# EAGLE design SparkFun_Qwiic_FS3000_1X1 (EAGLE 9.6.2)
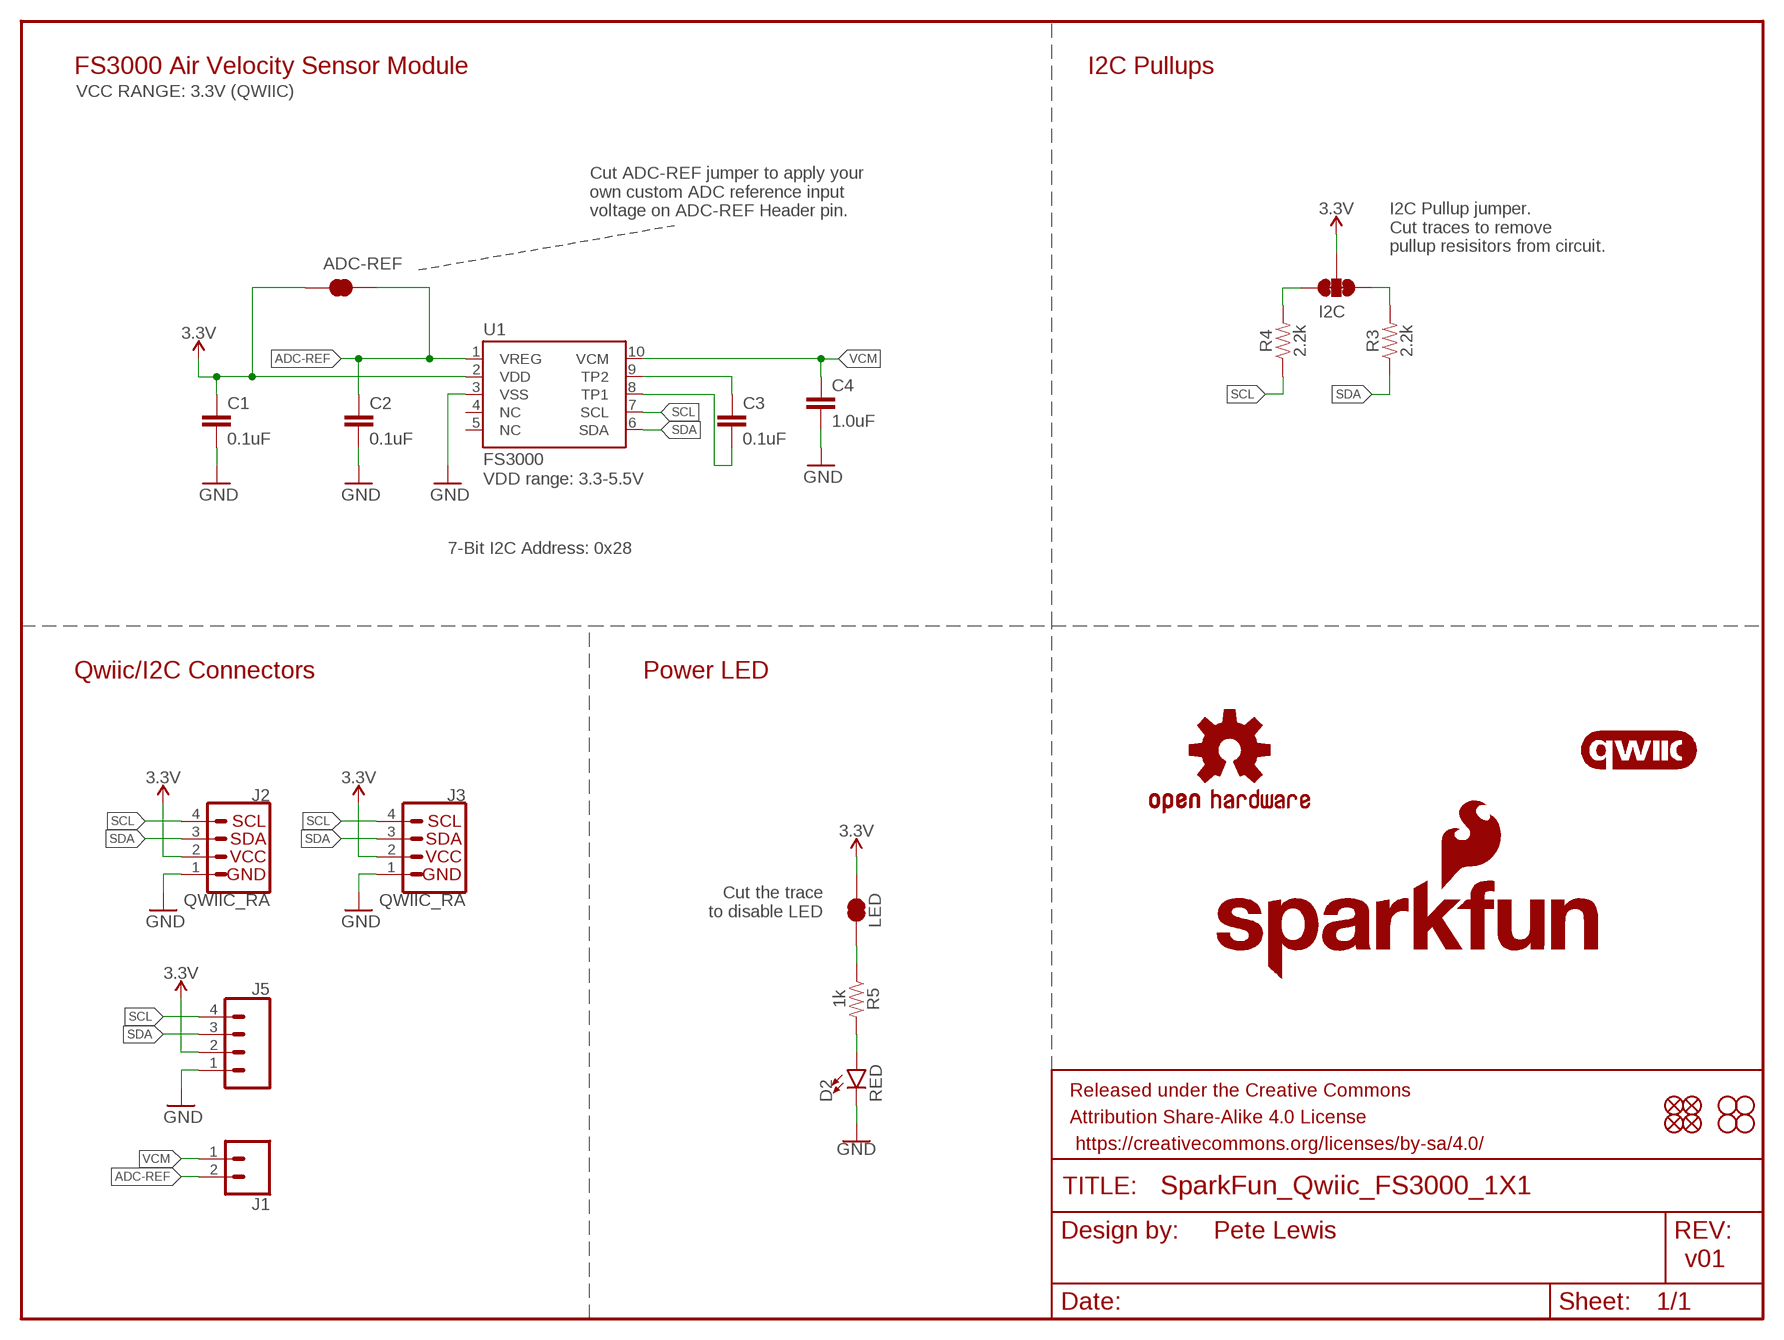
[diagram p0: schematic, sheet 1]

## Parts
ADC-REF  JUMPER-SMT_2_NC_TRACE_SILK  [SMT-JUMPER_2_NC_TRACE_SILK]
C1  0.1uF  0.1UF-0402T-16V-10%  [0402-TIGHT]
C2  0.1uF  0.1UF-0402T-16V-10%  [0402-TIGHT]
C3  0.1uF  0.1UF-0402T-16V-10%  [0402-TIGHT]
C4  1.0uF  1.0UF-0402T-16V-10%  [0402-TIGHT]
D2  RED  LED-RED0603  [LED-0603]
FRAME1  FRAME-LETTER  [CREATIVE_COMMONS]
I2C  JUMPER-SMT_3_2-NC_TRACE_SILK  [SMT-JUMPER_3_2-NC_TRACE_SILK]
J1  CONN_021X02_NO_SILK  [1X02_NO_SILK]
J2  QWIIC_RA  QWIIC_CONNECTORJS-1MM  [JST04_1MM_RA]
J3  QWIIC_RA  QWIIC_CONNECTORJS-1MM  [JST04_1MM_RA]
J5  CONN_041X04_NO_SILK  [1X04_NO_SILK]
JP1  LED  JUMPER-SMT_2_NC_TRACE_SILK  [SMT-JUMPER_2_NC_TRACE_SILK]
JP2  FIDUCIALUFIDUCIAL  [FIDUCIAL-MICRO]
JP3  STAND-OFF  [STAND-OFF]
JP4  STAND-OFF  [STAND-OFF]
JP5  FIDUCIALUFIDUCIAL  [FIDUCIAL-MICRO]
JP6  FIDUCIALUFIDUCIAL  [FIDUCIAL-MICRO]
JP7  STAND-OFF  [STAND-OFF]
JP8  STAND-OFF  [STAND-OFF]
JP11  FIDUCIALUFIDUCIAL  [FIDUCIAL-MICRO]
LOGO1  OSHW-LOGOMINI  [OSHW-LOGO-MINI]
LOGO3  SFE_LOGO_NAME_FLAME.1_INCH  [SFE_LOGO_NAME_FLAME_.1]
LOGO4  QWIIC_LOGO_5MM  [QWIIC_5MM]
LOGO5  SFE_LOGO_NAME_FLAME.1_INCH  [SFE_LOGO_NAME_FLAME_.1]
R3  2.2k  2.2KOHM-0402T-1/16W-1%  [0402-TIGHT]
R4  2.2k  2.2KOHM-0402T-1/16W-1%  [0402-TIGHT]
R5  1k  1KOHM-0402T-1/16W-1%  [0402-TIGHT]
U1  FS3000  [FS3000]

## Nets
3.3V: ADC-REF.1 C1.1 I2C.2 J2.2 J3.2 J5.2 JP1.2 U1.2(VDD)
ADC-REF: ADC-REF.2 C2.1 J1.2 U1.1(VREG)
GND: C1.2 C2.2 C4.2 D2.C J2.1 J3.1 J5.1 U1.3(VSS)
N$1: I2C.1 R3.2
N$2: I2C.3 R4.2
N$3: C3.1 U1.9(TP2)
N$4: C3.2 U1.8(TP1)
N$6: D2.A R5.2
N$8: JP1.1 R5.1
SCL: J2.4 J3.4 J5.4 R4.1 U1.7(SCL)
SDA: J2.3 J3.3 J5.3 R3.1 U1.6(SDA)
VCM: C4.1 J1.1 U1.10(VCM)
Unconnected: U1.4(NC) U1.5(NC)

## Notes on the sheet
- FS3000 Air Velocity Sensor Module | I2C Pullups
- VCC RANGE: 3.3V (QWIIC)
- Cut ADC-REF jumper to apply your 
  own custom ADC reference input 
  voltage on ADC-REF Header pin.
- I2C Pullup jumper. 
  Cut traces to remove
  pullup resisitors from circuit.
- VDD range: 3.3-5.5V
- 7-Bit I2C Address: 0x28
- Qwiic/I2C Connectors | Power LED
- Cut the trace
  to disable LED
- Pete Lewis
- v01

## Library data of the parts
ADC-REF JP1 = SparkFun-Jumpers:JUMPER-SMT_2_NC_TRACE: Normally closed trace jumper This jumper has a trace between two pads so it's normally closed (NC). Use a razor knife to open the connection. For best results follow the IPC guidelines for cutting traces: Cutout at least 0.063 mm (0.005 in). Remove all loose material to clean up the cut area. Seal the cut with an approved epoxy. Reapply solder to reclose the connection.
C1-C3 = SparkFun-Capacitors:0.1UF: 0.1µF ceramic capacitors A capacitor is a passive two-terminal electrical component used to store electrical energy temporarily in an electric field.; PROD_ID: CAP-12416
C4 = SparkFun-Capacitors:1.0UF: 1µF ceramic capacitors A capacitor is a passive two-terminal electrical component used to store electrical energy temporarily in an electric field.; PROD_ID: CAP-12417
D2 = SparkFun-LED:LED-RED: Red SMD LED Used in manufacturing of most products at SparkFun Packages: 0603 - SMD 0603 package [Product Link] <http://docs.avagotech.com/docs/AV02-0551EN> 0603 SMART - SMD 0603 SMART package ( more efficient and expensive)[Product Link] <http://www.osram-os.com/Graphics/XPic2/00077099_0.pdf> 1206 - SMD1206 package [Product Link] <https://www.sparkfun.com/datasheets/DevTools/LilyPad/Q150OVS4.pdff> SparkFun Products: Pro Mini 328 -5V <https://www.sparkfun.com/products/821> RedBoard <https://www.sparkfun.com/products/12757> IOIO-OTG <https://www.sparkfun.com/products/13613>; PROD_ID: DIO-00819
FRAME1 = SparkFun-Aesthetics:FRAME-LETTER: Schematic Frame - Letter Standard 8.5x11 US Letter frame
I2C = SparkFun-Jumpers:JUMPER-SMT_3_2-NC_TRACE: Normally closed trace jumper (2 of 2 connections) This jumper has a trace between all three pads so they are normally closed (NC). Use a razor knife to open the connection(s). For best results follow the IPC guidelines for cutting traces: Cutout at least 0.063 mm (0.005 in). Remove all loose material to clean up the cut area. Seal the cut with an approved epoxy. Reapply solder to reclose the connection(s).
J1 = SparkFun-Connectors:CONN_02: Multi connection point. Often used as Generic Header-pin footprint for 0.1 inch spaced/style header connections On any of the 0.1 inch spaced packages, you can populate with these: Break Away Headers - Straight <https://www.sparkfun.com/products/116> (PRT-00116) Break Away Male Headers - Right Angle <https://www.sparkfun.com/products/553> (PRT-00553) Female Headers <https://www.sparkfun.com/products/115> (PRT-00115) Break Away Headers - Machine Pin <https://www.sparkfun.com/products/117> (PRT-00117) Break Away Female Headers - Swiss Machine Pin <https://www.sparkfun.com/products/743> (PRT-00743) For SCREWTERMINALS and SPRING TERMINALS visit here: Screw Terimnals on SparkFun.com <https://www.sparkfun.com/search/results?term=Screw+Terminals> (5mm/3.5mm/2.54mm spacing) This device is also useful as a general connection point to wire up your design to another part of your project. Our various solder wires solder well into these plated through hole pads. Hook-Up Wire - Assortment (Stranded, 22 AWG) <https://www.sparkfun.com/products/11375> (PRT-11375) Hook-Up Wire - Assortment (Solid Core, 22 AWG) <https://www.sparkfun.com/products/11367> (PRT-11367) View the entire wire category on our website here <https://www.sparkfun.com/categories/141> Special notes: Molex polarized connector foot print use with: PRT-08233 with associated crimp pins and housings. 2.54_SCREWTERM for use with PRT-10571. 3.5mm Screw Terminal footprints for PRT-08084 5mm Screw Terminal footprints for use with PRT-08432
J2 J3 = SparkFun-Connectors:QWIIC_CONNECTOR: SparkFun I2C Standard Qwiic Connector An SMD 1mm pitch JST connector makes it easy and quick (get it? Qwiic?) to connect I2C devices to each other. The Qwiic system <http://www.sparkfun.com/qwiic> enables fast and solderless connection between popular platforms and various sensors and actuators. We carry 200mm <https://www.sparkfun.com/products/14204>, 100mm <https://www.sparkfun.com/products/14205>, 50mm <https://www.sparkfun.com/products/14206>, and breadboard friendly <https://www.sparkfun.com/products/14207> Qwiic cables. We also offer 10 pcs strips <https://www.sparkfun.com/products/14323> the SMD connectors.; PROD_ID: CONN-13694; VALUE: QWIIC_RIGHT_ANGLE
J5 = SparkFun-Connectors:CONN_04: Multi connection point. Often used as Generic Header-pin footprint for 0.1 inch spaced/style header connections On any of the 0.1 inch spaced packages, you can populate with these: Break Away Headers - Straight <https://www.sparkfun.com/products/116> (PRT-00116) Break Away Male Headers - Right Angle <https://www.sparkfun.com/products/553> (PRT-00553) Female Headers <https://www.sparkfun.com/products/115> (PRT-00115) Break Away Headers - Machine Pin <https://www.sparkfun.com/products/117> (PRT-00117) Break Away Female Headers - Swiss Machine Pin <https://www.sparkfun.com/products/743> (PRT-00743) For SCREWTERMINALS and SPRING TERMINALS visit here: Screw Terimnals on SparkFun.com <https://www.sparkfun.com/search/results?term=Screw+Terminals> (5mm/3.5mm/2.54mm spacing) This device is also useful as a general connection point to wire up your design to another part of your project. Our various solder wires solder well into these plated through hole pads. Hook-Up Wire - Assortment (Stranded, 22 AWG) <https://www.sparkfun.com/products/11375> (PRT-11375) Hook-Up Wire - Assortment (Solid Core, 22 AWG) <https://www.sparkfun.com/products/11367> (PRT-11367) View the entire wire category on our website here <https://www.sparkfun.com/categories/141> Special notes: Molex polarized connector foot print use with SKU : PRT-08231 with associated crimp pins and housings. 1MM SMD Version SKU: PRT-10208; PROD_ID: CONN-09696
JP2 JP5 JP6 JP11 = SparkFun-Aesthetics:FIDUCIAL: Fiducial Alignment Points Point-of-reference for pick-and-place machines and other optical instruments.
JP3 JP4 JP7 JP8 = SparkFun-Hardware:STAND-OFF: Stand Off Drill holes for mechanically mounting via screws, standoffs, etc. Note: Use the keepout ring to avoid running the screw head into surrounding components. Variant Overviews STAND-OFF - Mechanical footprint for a #4 phillips button head screw. STAND-OFF-TIGHT - Mechanical footprint for a #4 phillips button head screw, Example SparkFun Products Screw - Phillips Head (1/4", 4-40, 10 pack) <https://www.sparkfun.com/products/10453> (PRT-10453) Screw - Phillips Head (1/2", 4-40, 10 pack) <https://www.sparkfun.com/products/10452> (PRT-10452) Screw - Phillips Head (3/4", 4-40, 10 pack) <https://www.sparkfun.com/products/10451> (PRT-10451) Screw - Phillips Head (1", 4-40, 10 pack) <https://www.sparkfun.com/products/10450> (PRT-10450)
LOGO1 = SparkFun-Aesthetics:OSHW-LOGO: Open-Source Hardware (OSHW) Logo This logo indicates the piece of hardware it is found on incorporates a OSHW license and/or adheres to the definition of open source hardware found here: http://freedomdefined.org/OSHW
LOGO3 LOGO5 = SparkFun-Aesthetics:SFE_LOGO_NAME_FLAME: SparkFun Font Logo w/ Flame This is the SparkFun full logo. The logo on the schematic will always be the same size; the package variant is the height of the flame part of the logo. Default layer for the logo on the board is tSilk.
LOGO4 = SparkFun-Aesthetics:QWIIC_LOGO: Qwiic Logos for placement on schematic and PCB. The 5.5mm silk logo is best for placing next to Qwiic connector.
R3 R4 = SparkFun-Resistors:2.2KOHM: 2.2kΩ resistor A resistor is a passive two-terminal electrical component that implements electrical resistance as a circuit element. Resistors act to reduce current flow, and, at the same time, act to lower voltage levels within circuits. - Wikipedia; PROD_ID: RES-14341
R5 = SparkFun-Resistors:1KOHM: 1kΩ resistor A resistor is a passive two-terminal electrical component that implements electrical resistance as a circuit element. Resistors act to reduce current flow, and, at the same time, act to lower voltage levels within circuits. - Wikipedia; PROD_ID: RES-14342
U1 = FS3000:FS3000: FS3000 Air Velocity Sensor Module by Renesas -Surface-mount type air velocity module utilizing a MEMS thermopile-based sensor. -Digital output with 12-bit resolution. The sensor comprises a “solid” thermal isolation technology and siliconcarbide coating to protect it from abrasive wear and water condensation. -Compact design fit for low profile enclosures.; PROD_ID: IC-16078

## Board
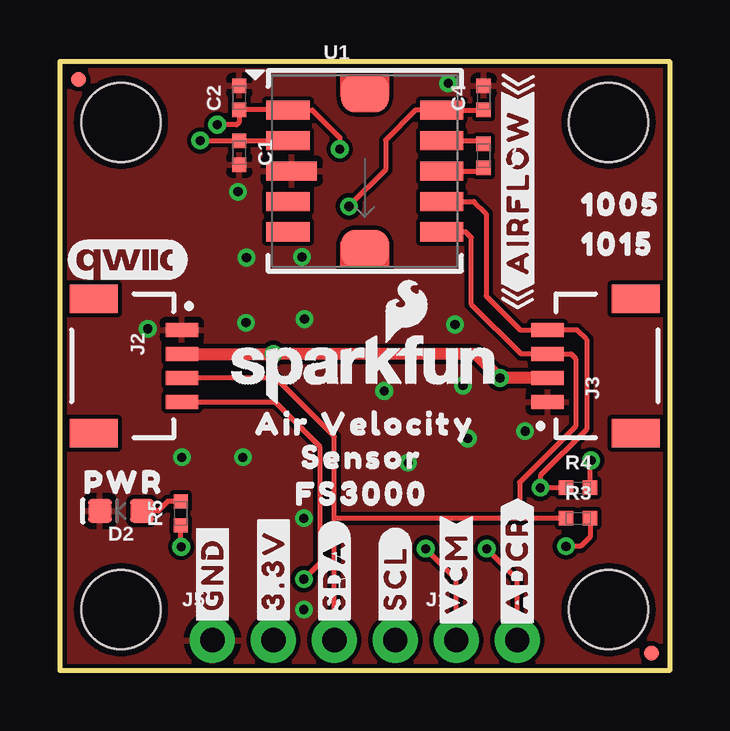
[diagram p1: board, top side]
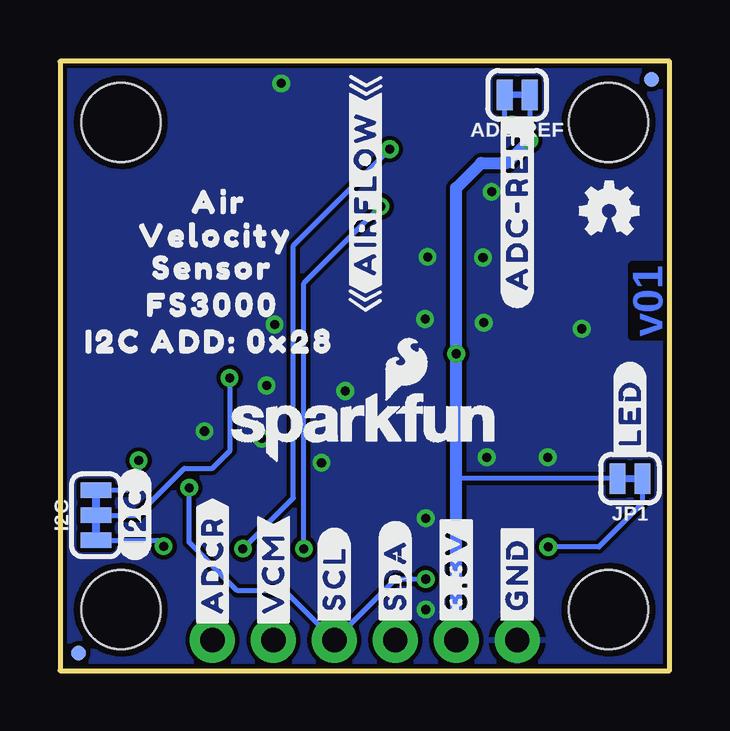
[diagram p2: board, bottom side, seen from below]

Size 25.4 x 25.4 mm. Coordinates in mm from the lower left corner, seen from the top.
Outline: 0,0 0,25.4 25.4,25.4 25.4,0 0,0
Copper layers (1*16): Top 0.035mm / dielectric 1.5mm / Bottom 0.035mm
Design rules "SparkFun-2-Layer-General-JLCPCB": minimum track width 7mil, minimum drill 0.3mm, track to track 7mil, track to pad 7mil, pad to pad 7mil, via to via 7mil, smd to smd 7mil, copper to edge 7mil, drill to drill 7mil, minimum pad ring 7mil, minimum via ring 7mil, stop-mask expansion 3mil, vias tented up to drill 25mil, thermal gap 10mil

### Footprints (pad centres in the part's own frame; a part is rotated, then mirrored left to right if it is on the bottom)
SMT-JUMPER_2_NC_TRACE_SILK = smd 0.66 x 1.27: 1 -0.521,0; 2 0.521,0
0402-TIGHT = smd 0.6 x 0.6: 1 -0.5,0; 2 0.5,0
LED-0603 = smd 1 x 1: A -0.877,0; C 0.877,0
SMT-JUMPER_3_2-NC_TRACE_SILK = smd 0.66 x 1.27: 1 -1.041,0; 2 0,0; 3 1.041,0
1X02_NO_SILK = drill 1.016 pad 1.88: 1 0,0; 2 2.54,0
JST04_1MM_RA = smd 0.6 x 1.35: 1 -1.5,0; 2 -0.5,0; 3 0.5,0; 4 1.5,0 | smd 1.2 x 2: NC1 2.8,-3.675; NC2 -2.8,-3.675
1X04_NO_SILK = drill 1.016 pad 1.88: 1 0,0; 2 2.54,0; 3 5.08,0; 4 7.62,0
FIDUCIAL-MICRO = smd 0.635 x 0.635: 1 0,0
STAND-OFF = hole 3.302: 0,0
FS3000 = smd 1.8 x 0.8: 1 -3.2,2.54; 2 -3.2,1.27; 4 -3.2,-1.27; 5 -3.2,-2.54; 6 3.2,-2.54; 7 3.2,-1.27; 8 3.2,0; 9 3.2,1.27; 10 3.2,2.54 | smd 2.1 x 0.8: 3 -3.05,0 | smd 2 x 1.59: 11 0,-3.24; 12 0,3.24

### Placement (x,y rotation side)
ADC-REF  6.35,24 180 bottom
C1  7.47,21.59 270 top
C2  7.47,23.88 90 top
C3  17.65,21.46 270 top
C4  17.65,23.88 90 top
D2  2.54,6.65 180 top
FRAME1  -16.51,-12.7 0 top  (outside the outline)
I2C  23.9,6.48 90 bottom
J1  16.51,1.27 0 top
J2  5.08,12.7 270 top
J3  20.32,12.7 90 top
J5  6.35,1.27 0 top
JP1  1.65,8 180 bottom
JP2  24.64,0.74 0 top
JP3  2.54,22.86 0 top
JP4  22.86,22.86 0 top
JP5  0.76,24.64 0 bottom
JP6  0.76,24.64 0 top
JP7  22.86,2.54 0 top
JP8  2.54,2.54 0 top
JP11  24.64,0.74 0 bottom
LOGO1  2.51,19.18 0 bottom
LOGO3  12.7,10.16 0 bottom
LOGO4  2.79,17.14 0 top
LOGO5  12.7,12.57 0 top
R3  21.59,6.35 0 top
R4  21.59,7.62 0 top
R5  5.03,6.55 90 top
U1  12.7,20.83 0 top
U$3  [#SCL#0]  13.97,1.78 90 bottom
U$4  [#SDA#0]  11.43,1.78 90 bottom
U$5  [#GND#0]  6.35,1.78 90 top
U$6  [#GND#0]  6.35,1.78 90 bottom
U$7  [#3#3V#0]  8.89,1.78 90 top
U$8  [#3#3V#0]  8.89,1.78 90 bottom
U$9  [#SDA#0]  11.43,1.78 90 top
U$10  [#ADCR#4]  19.05,1.65 90 top
U$11  [#SCL#0]  13.97,1.78 90 top
U$12  [10050]  23.37,19.43 0 top
U$13  [#ADCR#4]  19.05,1.65 90 bottom
U$14  [FS30001]  12.57,7.37 0 top
U$15  [#ADC#REF#0]  6.35,23.24 90 bottom
U$16  [VELOCITY30003]  14.1,10.29 0 top
U$17  [FS30001]  19.05,15.24 0 bottom
U$18  [AIR30004]  9.27,10.29 0 top
U$19  [SENSOR30005]  12.57,8.89 0 top
U$20  [VELOCITY30003]  18.9,18.14 0 bottom
U$21  [AIR30004]  18.77,19.53 0 bottom
U$22  [SENSOR30005]  19.05,16.79 0 bottom
U$23  [#AIRFLOW#0]  19.08,19.96 90 top
U$24  [#LED#0]  1.65,8.64 90 bottom
U$25  [PWR0]  2.64,7.85 0 top
U$26  [#AIRFLOW#0]  12.67,19.91 90 bottom
U$27  [#I2C#0]  22.28,8.38 90 bottom
U$28  [I2C_ADD#_0X280]  19.18,13.72 0 bottom
U$29  [10150]  23.24,17.78 0 top
U$30  [#VCM#3]  16.51,1.65 90 top
U$31  [#VCM#3]  16.51,1.65 90 bottom

### Tracks (layer width: path | path; a pad name or v marks a point on that pad's centre or on a via)
3.3V  (via drill 0.38)
  Top 0.203: v5.84,22.1 C1.1 U1.2
  Top 0.508: J2.2 v8.88,13.2 | v8.88,13.2 v8.89,13.21 | J3.2 v18.33,12.2 17.33,13.2 v8.88,13.2
  Bottom 0.203: ADC-REF.1 5.83,22.11 v5.84,22.1 | JP1.2 8.89,8 | I2C.2 22.17,6.48 20.22,8.43 19.05,8.43 18.31,9.17 18.31,12.18 v18.33,12.2
  Bottom 0.508: J5.2 8.89,8 v8.89,13.21 8.89,20.12 7.85,21.16 6.78,21.16 v5.84,22.1
ADC-REF  (via drill 0.38)
  Top 0.203: v6.55,22.76 7.36,22.76 7.47,22.87 C2.1 U1.1 10.52,23.37 11.66,22.23 v11.66,21.74 | J1.2 19.05,3.81 v17.78,5.08
  Bottom 0.203: v6.55,22.76 6.87,23.08 ADC-REF.2 | v11.66,21.74 15.67,17.73 15.67,7.19 v17.78,5.08
GND  (via drill 0.38)
  other vias: 19.38,9.98 16.79,11.89 16.99,9.68 10.08,17.25 10.19,14.66 7.75,14.5 7.77,17.22 16.18,24.49 7.42,19.96 3.66,14.25 14.5,8.66 13.51,11.66 7.62,8.89 5.08,8.89 10.16,2.54 10.16,6.35 16.46,14.43
  pour Bottom: 0,0 0,25.4 25.4,25.4 25.4,0
  pour Top: 0,0 0,25.4 25.4,25.4 25.4,0
N$1  (via drill 0.38)
  Top 0.203: R3.2 22.09,5.58 21.69,5.18 v21.08,5.18
  Bottom 0.203: I2C.1 21.34,5.44 v21.08,5.18
N$2  (via drill 0.38)
  Top 0.203: R4.2 22.09,8.73 v22.12,8.76
  Bottom 0.203: v22.12,8.76 22.12,7.98 22.58,7.52 I2C.3
N$3
  Top 0.203: U1.9 17.52,22.1 C3.1
N$4
  Top 0.203: U1.8 17.52,20.83 C3.2
N$6
  Top 0.203: R5.2 4.49,7.05 4.09,6.66 D2.A
N$8  (via drill 0.38)
  Top 0.203: v5.05,5.16 5.03,5.18 R5.1
  Bottom 0.203: JP1.1 1.13,6.97 2.95,5.16 v5.05,5.16
SCL  (via drill 0.38)
  Top 0.203: U1.7 17.25,19.56 17.75,19.05 17.75,15.62 19.18,14.2 J3.4 21.54,14.2 21.95,13.79 21.95,10.06 20.02,8.13 v20.02,7.62 R4.1 | J2.4 8.97,11.2 10.82,9.35 10.82,4.47 v10.16,3.81
  Bottom 0.203: v10.16,3.81 11.43,3.81 J5.4 16.03,3.33 18.01,3.33 20.02,5.33 v20.02,7.62
SDA
  Top 0.203: U1.6 16.92,18.29 17.14,18.06 17.14,15.27 19.21,13.2 J3.3 21.29,13.2 21.49,13.01 21.49,10.19 19.15,7.85 19.15,6.35 | J2.3 8.98,12.2 11.43,9.75 11.43,6.35 | J5.3 11.43,6.35 | R3.1 19.15,6.35 | 19.15,6.35 11.43,6.35
VCM  (via drill 0.38)
  Top 0.203: C4.1 17.64,23.37 U1.10 14.81,23.37 13.56,22.12 13.56,20.88 v12.04,19.36 | J1.1 16.51,3.81 v15.24,5.08
  Bottom 0.203: v12.04,19.36 15.24,16.15 v15.24,5.08

### Text on the board
Bottom: v01
Measures: Measure Units: INCHES
tDocu: Pete Lewis